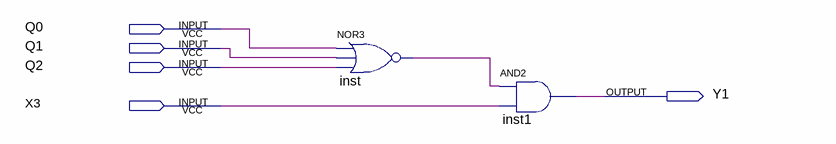
[diagram p0: schematic sheet]
// Quartus schematic Y1.bdf as structural Verilog: 2 symbols, 5 pins
module Y1 (
  input  Q0,
  input  Q1,
  input  Q2,
  input  X3,
  output Y1
);

  wire inst_out;

  nor inst (inst_out, Q0, Q1, Q2);
  and inst1 (Y1, inst_out, X3);
endmodule
